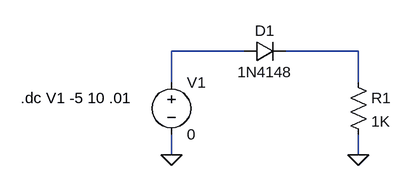
[diagram p0: schematic diode.asc]
diode.asc, the LTspice schematic file:
Version 4.1
SHEET 1 880 680
WIRE 128 128 16 128
WIRE 304 128 192 128
WIRE 16 176 16 128
WIRE 304 176 304 128
WIRE 16 288 16 256
WIRE 304 288 304 256
FLAG 16 288 0
FLAG 304 288 0
SYMBOL voltage 16 160 R0
WINDOW 123 0 0 Left 0
WINDOW 39 0 0 Left 0
SYMATTR InstName V1
SYMATTR Value 0
SYMBOL res 288 160 R0
SYMATTR InstName R1
SYMATTR Value 1K
SYMBOL diode 128 144 R270
WINDOW 0 32 32 VTop 2
WINDOW 3 0 32 VBottom 2
SYMATTR InstName D1
SYMATTR Value 1N4148
TEXT -216 200 Left 2 !.dc V1 -5 10 .01

The netlist it stands for:
* diode.asc
V1 N001 0 0
R1 N002 0 1K
D1 N001 N002 1N4148
.model D D
.lib standard.dio
.dc V1 -5 10 .01
.backanno
.end